# Altium project PayLoad Subsystem_AVR.PrjPcb
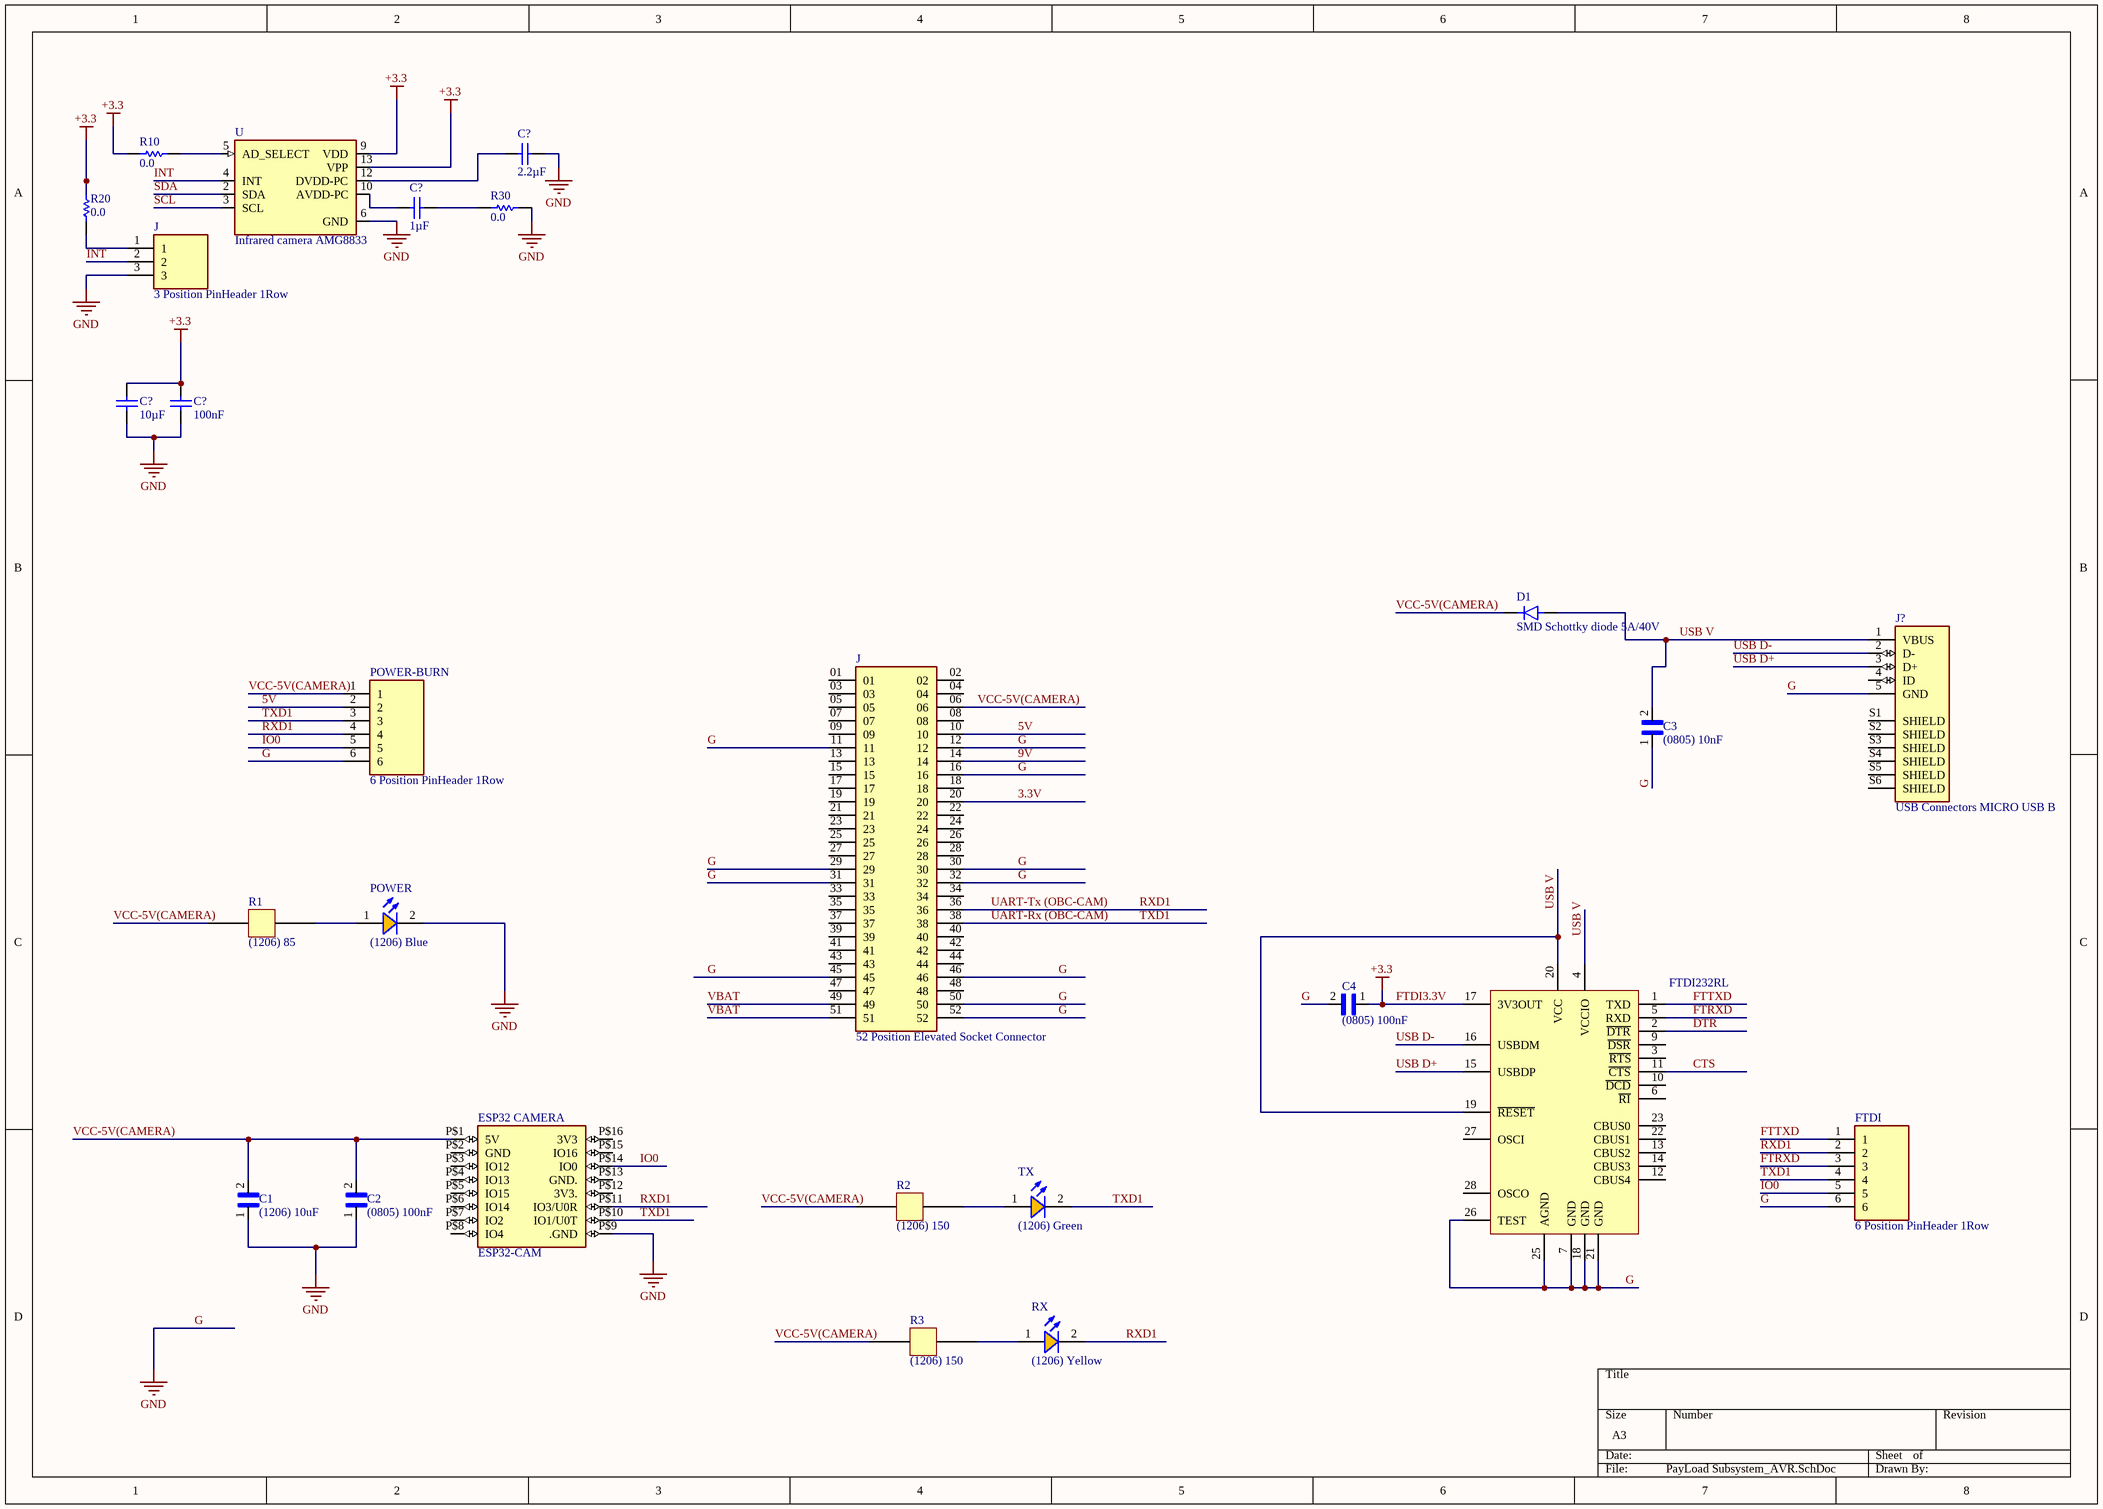
[diagram p0: PayLoad Subsystem_AVR.SchDoc]
1 sheet, 26 parts. Net scope: global (net labels, ports and power ports of the same name join across sheets).
Board file: PayLoad Subsystem_AVR.PcbDoc

## Sheet PayLoad Subsystem_AVR.SchDoc
size A3; SheetNumber: 1; SheetTotal: 1

### Parts
(Parts that share a designator on the sheet are numbered #1, #2 ... from top to bottom, then left to right.)
C1  (1206) 10uF  [CAPC3216X125N0]
C2  (0805) 100nF  [CAPC2012X95N-0]
C3  (0805) 10nF  [CAPC2012X95N-0]
C4  (0805) 100nF  [CAPC2012X95N-0]
C?#1  Capacitance: 2.2µF  [0603 - cap]  (hidden comment: Cap_CER_1U_10V_0603)
C?#2  Capacitance: 1µF  [0603 - cap]  (hidden comment: Cap_CER_1U_10V_0603)
C?#3  Capacitance: 10µF  [0603 - cap]  (hidden comment: Cap_CER_1U_10V_0603)
C?#4  Capacitance: 100nF  [0603 - cap]  (hidden comment: Cap_CER_1U_10V_0603)
D1  SMD Schottky diode 5A/40V  [DIOM5227X270N]
ESP32_CAMERA  ESP32-CAM  [ESP32-CAM]
FTDI  6 Position PinHeader 1Row  [TE_6-146285-6]
FTDI232RL  IC_FT232RL  [SSOP-28]  (value not drawn)
J#1  3 Position PinHeader 1Row  [TE_3-103327-3]
J#2  52 Position Elevated Socket Connector  [SAMTEC_ESQ-126-39-G-D]
J?  USB Connectors MICRO USB B  [MOLEX_47346-0001]
POWER  (1206) Blue  [RESC3015X65-01]
POWER-BURN  6 Position PinHeader 1Row  [TE_6-146285-6]
R1  (1206) 85  [CAPC3216X125N0]
R2  (1206) 150  [CAPC3216X125N0]
R3  (1206) 150  [CAPC3216X125N0]
R10  Resistance (Ohms): 0.0  [0603]  (hidden comment: RES_0_0.1W_0603)
R20  Resistance (Ohms): 0.0  [0603]  (hidden comment: RES_0_0.1W_0603)
R30  Resistance (Ohms): 0.0  [0603]  (hidden comment: RES_0_0.1W_0603)
RX  (1206) Yellow  [RESC3015X65-01]
TX  (1206) Green  [RESC3015X65-01]
U  Infrared camera AMG8833  [XDCR_AMG8833]

### Nets
FTDI3.3V: C4.1 C?#3.2 C?#4.2 FTDI232RL.17(3V3OUT) R10.1 R20.2 U.9(VDD) U.13(VPP)  [also labelled +3.3]
G: C1.1 C2.1 C3.1 C4.2 C?#1.2 C?#3.1 C?#4.1 ESP32_CAMERA.P$9(.GND) FTDI.6 FTDI232RL.7(GND) FTDI232RL.18(GND) FTDI232RL.21(GND) FTDI232RL.25(AGND) FTDI232RL.26(TEST) J#1.3 J#2.11 J#2.12 J#2.16 J#2.29 J#2.30 J#2.31 J#2.32 J#2.45 J#2.46 J#2.50 J#2.52 J?.5(GND) POWER.2(K) POWER-BURN.6 R30.2 U.6(GND)  [also labelled GND]
NC: FTDI232RL.8(NC) FTDI232RL.24(NC)
3.3V: J#2.20
5V: J#2.10 POWER-BURN.2
9V: J#2.14
CTS: FTDI232RL.11(~{CTS})
DTR: FTDI232RL.2(~{DTR})
FTRXD: FTDI.3 FTDI232RL.5(RXD)
FTTXD: FTDI.1 FTDI232RL.1(TXD)
INT: J#1.2 U.4(INT)
IO0: ESP32_CAMERA.P$14(IO0) FTDI.5 POWER-BURN.5
RXD1: ESP32_CAMERA.P$11(IO3/U0R) FTDI.2 J#2.36 POWER-BURN.4 RX.2(K)  [also labelled UART-Tx (OBC-CAM)]
SCL: U.3(SCL)
SDA: U.2(SDA)
TXD1: ESP32_CAMERA.P$10(IO1/U0T) FTDI.4 J#2.38 POWER-BURN.3 TX.2(K)  [also labelled UART-Rx (OBC-CAM)]
USB D+: FTDI232RL.15(USBDP) J?.3(D+)
USB D-: FTDI232RL.16(USBDM) J?.2(D-)
USB V: C3.2 D1.A FTDI232RL.4(VCCIO) FTDI232RL.19(~{RESET}) FTDI232RL.20(VCC) J?.1(VBUS)
VBAT: J#2.49 J#2.51
VCC-5V(CAMERA): C1.2 C2.2 D1.C(K) ESP32_CAMERA.P$1(5V) J#2.06 POWER-BURN.1 R1.1 R2.1 R3.1
NetC?#1_1: C?#1.1 U.12(DVDD-PC)
NetC?#2_1: C?#2.1 U.10(AVDD-PC)
NetC?#2_2: C?#2.2 R30.1
NetJ#1_1: J#1.1 R20.1
NetPOWER_1: POWER.1(A) R1.2
NetR2_2: R2.2 TX.1(A)
NetR3_2: R3.2 RX.1(A)
NetR10_2: R10.2 U.5(AD_SELECT)

Not connected (* = marked no-connect by the designer): ESP32_CAMERA P$2(GND) P$3(IO12) P$4(IO13) P$5(IO15) P$6(IO14) P$7(IO2) P$8(IO4) P$12(3V3.) P$13(GND.) P$15(IO16) P$16(3V3); FTDI232RL 3(~{RTS}) 6(~{RI}) 9(~{DSR}) 10(~{DCD}) 12(CBUS4) 13(CBUS2) 14(CBUS3) 22(CBUS1) 23(CBUS0) 27(OSCI) 28(OSCO); J#2 01 02 03 04 05 07 08 09 13 15 17 18 19 21 22 23 24 25 26 27 28 33 34 35 37 39 40 41 42 43 44 47 48; J? 4(ID) S1(SHIELD) S2(SHIELD) S3(SHIELD) S4(SHIELD) S5(SHIELD) S6(SHIELD)

### Library data of the parts
C1 = Capacitor 1206: UMF316B7103KFHT/1206 Capacitor; Package: None; Price: None; Value: *; MP: UMF316B7103KFHT; Availability: Unavailable
C2-C4 = Capacitor 0805: UMK212SD103KD-T/CAP CER 10000PF 50V 0805; Package: None; Price: None; Value: *; MP: UMK212SD103KD-T; Availability: Unavailable
C?#1-C?#4 = Capacitor 0603: Capacitor; Manufacturer: Taiyo Yuden; Manufacturer Part Number: LMK107B7105KA-T; Tolerance: ±10%; Voltage - Rated: 10V; Temperature Coefficient: X7R; Supplier 1: Digi-Key; RoHS: RoHS Compliant; Category: Capacitors; Stock 1: 600713; Pricing 1: 1=0.1, 10=0.042, 25=0.0308, 50=0.023, 100=0.0188, 250=0.01576, 500=0.01344, 1000=0.01056 (USD); Packaging: Cut Tape (CT); Part Status: Active; Operating Temperature: -55°C ~ 125°C; Features: -; Ratings: -; Applications: General Purpose; Mounting Type: Surface Mount, MLCC; Package / Case: 0603 (1608 Metric); Size / Dimension: 0.063" L x 0.031" W (1.60mm x 0.80mm); Height - Seated (Max): -; Thickness (Max): 0.035" (0.90mm); Lead Spacing: -; Lead Style: -; ComponentLink1URL: http://ds.yuden.co.jp/TYCOMPAS/ut/detail.do?productNo=LMK107B7105KA-T&fileName=LMK107B7105KA-T_SS&mode=specSheetDownload; ComponentLink1Description: http://ds.yuden.co.jp/TYCOMPAS/ut/detail.do?productNo=LMK107B7105KA-T&fileName=LMK107B7105KA-T_SS&mode=specSheetDownload; Supplier Part Number 1: 587-1242-1-ND
D1 = SMD Schottky diode 5A/40V: S1 Series 1000 V 1 A 1 uA Surface Mount General Purpose Rectifier - DO-214AC; MP: S1M; Price: None; Value: *; Availability: Unavailable; Package: None
ESP32_CAMERA = ESP32-CAM: The smallest 802.11b/g/n Wi-Fi BT SoC Module; MF: AI-Thinker; Price: None; Value: *; Check_prices: https://www.snapeda.com/parts/ESP32-CAM/AI-Thinker/view-part/5507632/?ref=eda; Package: Package; Availability: No availability data; MP: ESP32-CAM; SnapEDA_Link: https://www.snapeda.com/parts/ESP32-CAM/AI-Thinker/view-part/5507632/?ref=snap
FTDI POWER-BURN = 6 Position PinHeader 1Row: Connector Header Through Hole 6 position 0.100 (2.54mm); MP: 5-146285-6; MF: TE Connectivity; DigiKey-Purchase-URL: https://snapeda.com/shop?store=DigiKey&id=2411669; EU_RoHS_Compliance: Compliant; Package: None; Value: *; SnapEDA_Link: https://www.snapeda.com/parts/5-146285-6/TE%20Connectivity%20AMP%20Connectors/view-part/2411669/?ref=snap; Digi-Key_Part_Number: A122872-ND
FTDI232RL = IC_FT232RL: FT232R USB UART; Manufacturer: *; Note: *; ManufacturerPartNo: *
J#1 = 3 Position PinHeader 1Row: Conn Unshrouded Header HDR 3 POS 2.54mm Solder ST Thru-Hole Carton; MF: TE Connectivity; MP: 4-103327-5; Package: None; Value: *; TE_purchase_URL: https://www.te.com/usa-en/product-4-103327-5.html?te_bu=Cor&te_type=disp&te_campaign=seda_glo_cor-seda-global-disp-prtnr-fy19-seda-model-bom-cta_sma-317_1&elqCampaignId=32493; Price: None; SnapEDA_Link: https://www.snapeda.com/parts/4-103327-5/TE%20Connectivity%20AMP%20Connectors/view-part/2403997/?ref=snap; Availability: Unavailable; EU_RoHS_Compliance: Compliant
J#2 = 52 Position Elevated Socket Connector: ESQ-126-39-G-D/52 Position Elevated Socket Connector Through Hole; MF: Samtec; Package: None; MP: ESQ-126-39-G-D; Value: *; Availability: Unavailable; Price: None; SnapEDA_Link: https://www.snapeda.com/parts/ESQ-126-39-G-D/Samtec%20Inc./view-part/490181/?ref=snap
J? = USB Connectors MICRO USB B: USB Connectors MICRO USB B RECPT BTTM MOUNT ASSY; MP: 47346-0001; MF: Molex; Package: None; Purchase-URL: https://pricing.snapeda.com/search/part/47346-0001/?ref=eda; Check_prices: https://www.snapeda.com/parts/47346-0001/Molex/view-part/53503/?ref=eda; Value: *; Availability: Warning; Price: None; SnapEDA_Link: https://www.snapeda.com/parts/47346-0001/Molex/view-part/53503/?ref=snap
POWER RX TX = LED 1206: LED SMD 1206 High Quality Forward Voltage: 3.2 V / Brightness: 700 mcd; Manufacturer: Wurth Elektronik; Manufacturer Part Number: 150060AS75003; Chip Technology: AlInGaP; Dominant Wavelength: 605nm; Emitting Color: Amber; Forward Voltage: 2V; Luminous Intensity: 350mcd; Peak Wavelength: 610nm; Viewing Angle: 140°; ComponentLink1Description: Manufacturer Link; ComponentLink1URL: http://www.we-online.de; ComponentLink2Description: Datasheet; ComponentLink2URL: https://www.we-online.com/catalog/datasheet/150060AS75003.pdf; Height: 0.7mm; Length: 1.6mm; Mounting Technology: SMT; Operating Temperature max.: 100C; Operating Temperature min.: -40C; Packaging: Tape and Reel; Size: 0603; Width: 0.8mm
R1-R3 = Resistor 1206
R10 R20 R30 = Resistor 0603: Resistor; Manufacturer: Samsung Electro-Mechanics America, Inc.; Manufacturer Part Number: RC1608J000CS; Tolerance: Jumper; Power (Watts): 0.1W, 1/10W; Supplier 1: Digi-Key; RoHS: RoHS Compliant; Category: Resistors; Stock 1: 498586; Pricing 1: 1=0.1, 10=0.017, 25=0.0124, 50=0.0094, 100=0.0069, 250=0.00528, 500=0.00422, 1000=0.0031 (USD); Packaging: Cut Tape (CT); Part Status: Active; Composition: Thick Film; Features: Moisture Resistant; Temperature Coefficient: -; Operating Temperature: -55°C ~ 155°C; Package / Case: 0603 (1608 Metric); Supplier Device Package: 0603; Size / Dimension: 0.063" L x 0.031" W (1.60mm x 0.80mm); Height - Seated (Max): 0.022" (0.55mm); Number of Terminations: 2; Failure Rate: -; ComponentLink1URL: http://media.digikey.com/pdf/Data%20Sheets/Samsung%20PDFs/RC_Series_ds.pdf; ComponentLink1Description: http://media.digikey.com/pdf/Data%20Sheets/Samsung%20PDFs/RC_Series_ds.pdf; Supplier Part Number 1: 1276-3510-1-ND
U = Infrared camera AMG8833: Temperature Sensor Digital, Infrared _IR_ 14-SMD Module; MF: Panasonic Electronic; Value: *; Package: SMD-14 Panasonic; Price: None; MP: AMG8833; Availability: Unavailable; SnapEDA_Link: https://www.snapeda.com/parts/AMG8833/Panasonic%20Electronic%20Components/view-part/446696/?ref=snap